# EAGLE design DSI CSI Extender (EAGLE 6.6.0)
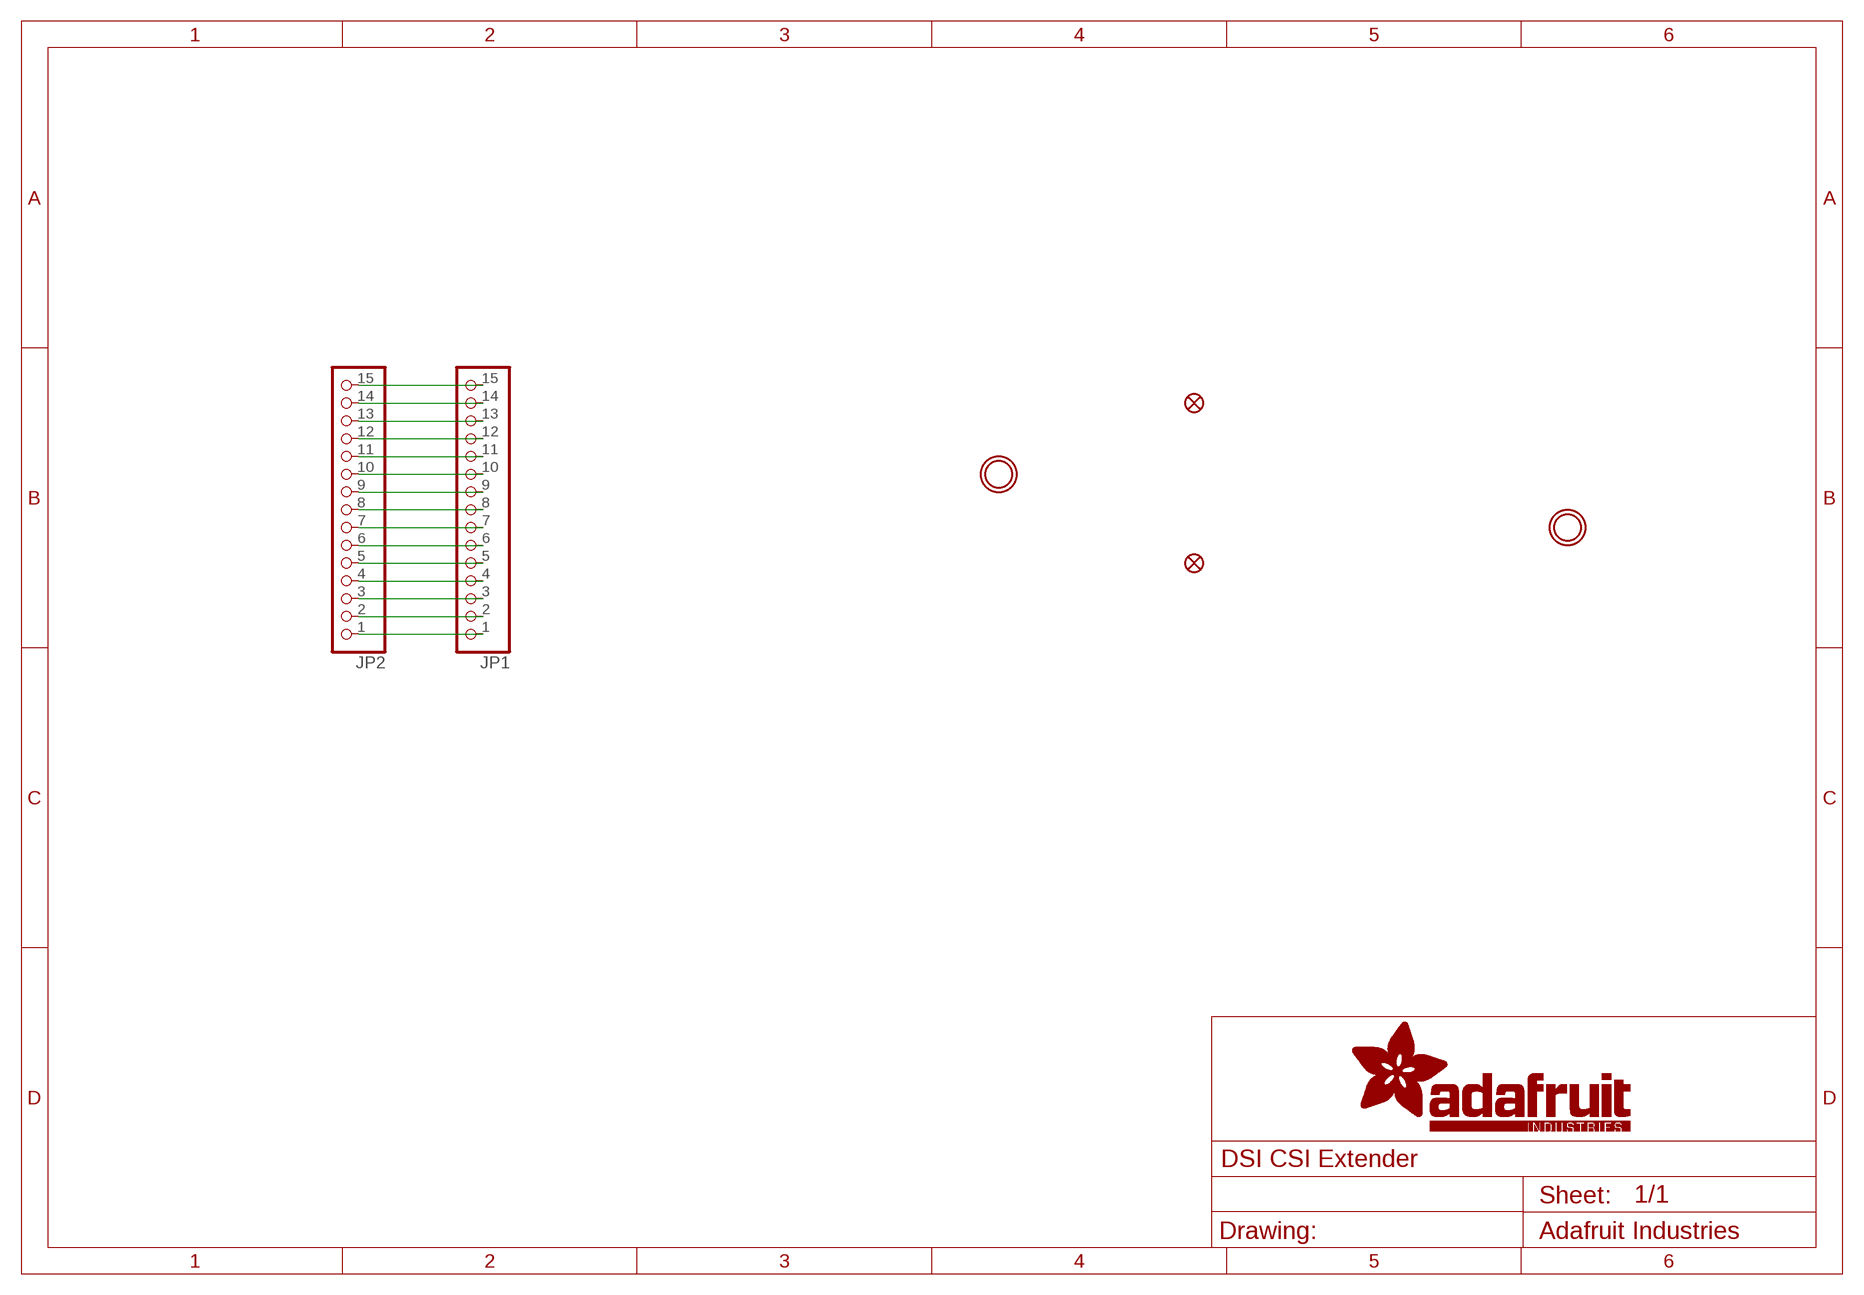
[diagram p0: schematic, sheet 1]

## Parts
FID1  FIDUCIAL_1MM  [FIDUCIAL_1MM]
FID2  FIDUCIAL_1MM  [FIDUCIAL_1MM]
JP1  HEADER-1X15_FPC1MM_PI  [FPC_15PIN_1.0MM]
JP2  HEADER-1X15_FPC1MM_PI  [FPC_15PIN_1.0MM]
U$2  MOUNTINGHOLE2.5  [MOUNTINGHOLE_2.5_PLATED]
U$3  MOUNTINGHOLE2.5  [MOUNTINGHOLE_2.5_PLATED]

## Nets
N$1: JP1.1 JP2.1
N$2: JP1.2 JP2.2
N$3: JP1.3 JP2.3
N$4: JP1.4 JP2.4
N$5: JP1.5 JP2.5
N$6: JP1.6 JP2.6
N$7: JP1.7 JP2.7
N$8: JP1.8 JP2.8
N$9: JP1.9 JP2.9
N$10: JP1.10 JP2.10
N$11: JP1.11 JP2.11
N$12: JP1.12 JP2.12
N$13: JP1.13 JP2.13
N$14: JP1.14 JP2.14
N$15: JP1.15 JP2.15

## Library data of the parts
FID1 FID2 = microbuilder:FIDUCIAL: Fiducial Alignment Points Various fiducial points for machine vision alignment.; BOM: EXCLUDE
JP1 JP2 = microbuilder:HEADER-1X15: 1x15 Header
U$2 U$3 = microbuilder:MOUNTINGHOLE: Mounting Hole For #2 screws (0.086"/2.18mm width, 0.094"/2.4mm hole) use 2.5mm; BOM: EXCLUDE

## Board
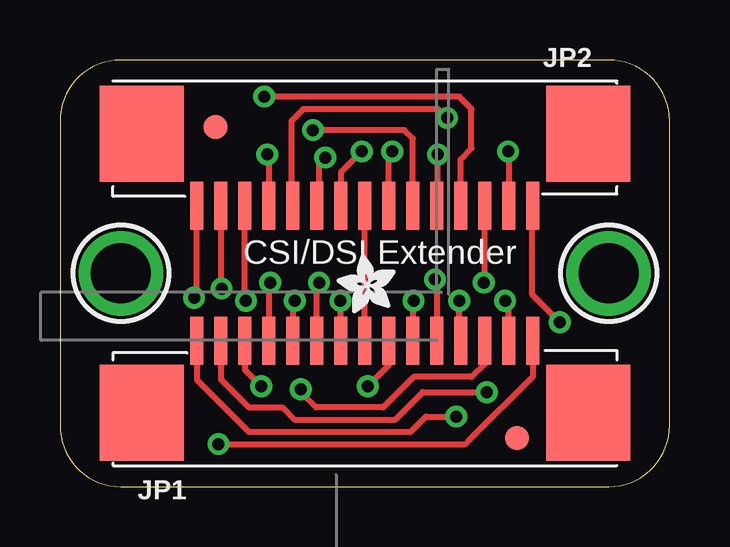
[diagram p1: board, top side]
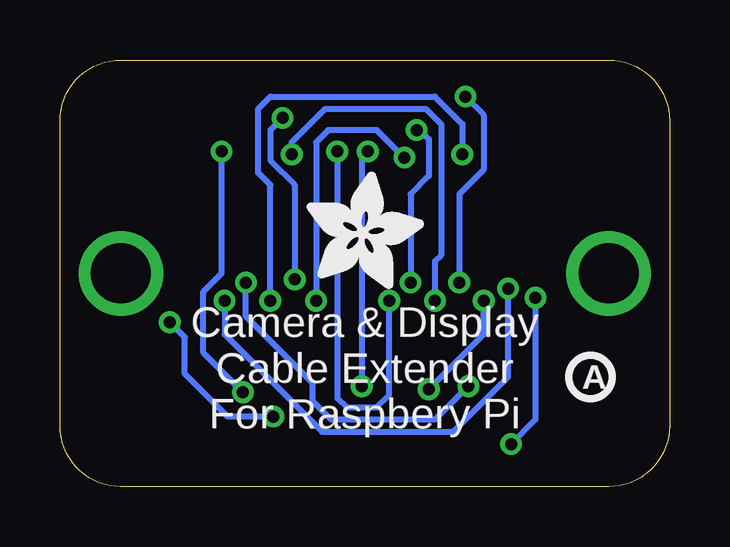
[diagram p2: board, bottom side, seen from below]

Size 25.4 x 17.78 mm. Coordinates in mm from the lower left corner, seen from the top.
Outline: 0,15.24 0,2.54 arc90 2.54,0 22.86,0 arc90 25.4,2.54 25.4,15.24 arc90 22.86,17.78 2.54,17.78 arc90 0,15.24
Copper layers (1*16): Top 0.035mm / dielectric 1.5mm / Bottom 0.035mm
Design rules "adafruit *": minimum track width 8mil, minimum drill 16mil, track to track 8mil, track to pad 8mil, pad to pad 8mil, via to via 8mil, smd to smd 8mil, copper to edge 10mil, drill to drill 8mil, minimum pad ring 10mil, minimum via ring 8mil, stop-mask expansion 4mil, vias tented up to drill 20mil, thermal gap 10mil

### Footprints (pad centres in the part's own frame; a part is rotated, then mirrored left to right if it is on the bottom)
FIDUCIAL_1MM = smd 1 x 1: 1 0,0
FPC_15PIN_1.0MM = smd 0.55 x 2: 1 -7,1; 2 -6,1; 3 -5,1; 4 -4,1; 5 -3,1; 6 -2,1; 7 -1,1; 8 0,1; 9 1,1; 10 2,1; 11 3,1; 12 4,1; 13 5,1; 14 6,1; 15 7,1 | smd 3.5 x 4: M1 -9.3,-2; M2 9.3,-2
MOUNTINGHOLE_2.5_PLATED = drill 2.5 pad 3.2: P$1 0,0

### Placement (x,y rotation side)
FID1  19.05,2.03 0 top
FID2  6.48,14.99 0 top
JP1  12.7,5.08 0 top
JP2  12.7,12.7 180 top
U$2  2.54,8.89 0 top
U$3  22.86,8.89 0 top
U$4  [ADAFRUIT_2.5MM]  13.97,7.24 90 top
U$5  [ADAFRUIT_5MM]  15.11,8.26 0 bottom
U$6  [PCBFEAT-REV-040]  3.3,4.57 0 bottom

### Tracks (layer width: path | path; a pad name or v marks a point on that pad's centre or on a via)
N$1  (via drill 0.5)
  Top 0.254: JP1.1 5.7,4.46 7.87,2.29 14.61,2.29 15.24,2.92 v16.51,2.92 | v20.83,6.86 19.68,8 19.68,11.69 JP2.1
  Bottom 0.254: v16.51,2.92 18.41,2.92 20.19,4.7 20.19,6.22 v20.83,6.86
N$2  (via drill 0.5)
  Top 0.254: JP1.2 6.7,4.48 7.87,3.3 9.27,3.3 9.78,2.79 13.97,2.79 15.11,3.94 v17.78,3.94 | v18.67,13.97 18.7,13.94 JP2.2
  Bottom 0.254: v17.78,3.94 19.43,5.59 19.43,8.13 18.67,8.89 v18.67,13.97
N$3  (via drill 0.5)
  Top 0.254: JP1.3 7.7,4.87 v8.38,4.19 | JP2.3 17.7,8.56 v17.65,8.51
  Bottom 0.254: v8.38,4.19 9.78,2.79 14.1,2.79 14.86,3.56 14.86,4.32 17.65,7.11 v17.65,8.51
N$4  (via drill 0.5)
  Top 0.254: JP2.4 16.7,13.65 17.14,14.1 17.14,15.75 16.64,16.26 v8.51,16.26 | v8.76,8.51 8.7,8.45 JP1.4
  Bottom 0.254: v8.51,16.26 7.75,15.49 7.75,13.21 8.76,12.19 v8.76,8.51
N$5  (via drill 0.5)
  Top 0.254: JP2.5 15.75,11.75 v15.75,13.84 | v9.78,7.75 9.7,7.67 JP1.5
  Bottom 0.254: v15.75,13.84 15.75,14.35 14.35,15.75 10.16,15.75 9.53,15.11 9.53,9.65 9.78,9.4 v9.78,7.75
N$6  (via drill 0.5)
  Top 0.254: JP2.6 14.7,14.51 14.35,14.86 v10.54,14.86 | JP1.6 10.7,8.41 v10.79,8.51
  Bottom 0.254: v10.54,14.86 10.54,14.99 10.03,14.48 10.03,12.95 10.79,12.19 v10.79,8.51
N$7  (via drill 0.5)
  Top 0.254: JP2.7 13.7,13.83 v13.84,13.97 | JP1.7 11.7,7.73 v11.68,7.75
  Bottom 0.254: v13.84,13.97 13.84,3.68 13.46,3.3 12.19,3.3 11.68,3.81 v11.68,7.75
N$8
  Top 0.254: JP1.8 JP2.8
N$9  (via drill 0.5)
  Top 0.254: JP1.9 13.7,5.06 v12.83,4.19 | v12.57,13.97 11.7,13.1 JP2.9
  Bottom 0.254: v12.57,13.97 12.83,13.72 v12.83,4.19
N$10  (via drill 0.5)
  Top 0.254: JP2.10 10.79,11.79 10.79,13.46 v11.05,13.72 | v14.73,7.75 14.7,7.71 JP1.10
  Bottom 0.254: v11.05,13.72 12.19,14.86 14.22,14.86 14.73,14.35 v14.73,7.75
N$11  (via drill 0.5)
  Top 0.254: JP2.11 9.65,11.75 9.65,15.24 10.16,15.75 15.75,15.75 v16.13,15.37 | v15.62,8.64 15.7,8.56 JP1.11
  Bottom 0.254: v16.13,15.37 16.64,14.86 16.64,13.59 15.62,12.57 v15.62,8.64
N$12  (via drill 0.5)
  Top 0.254: JP1.12 16.64,6.14 v16.64,7.75 | v8.64,13.84 8.7,13.78 JP2.12
  Bottom 0.254: v16.64,7.75 16.64,12.57 17.14,13.08 17.14,15.75 16.64,16.26 9.78,16.26 8.64,15.11 v8.64,13.84
N$13  (via drill 0.5)
  Top 0.254: JP1.13 17.7,5.13 17.14,4.57 14.73,4.57 13.46,3.3 10.67,3.3 10.03,3.94 v10.03,4.06 | v7.75,7.75 7.7,7.79 JP2.13
  Bottom 0.254: v10.03,4.06 7.75,6.35 v7.75,7.75
N$14  (via drill 0.5)
  Top 0.254: JP1.14 18.7,7.59 v18.54,7.75 | JP2.14 6.7,8.29 v6.73,8.26
  Bottom 0.254: v18.54,7.75 18.54,6.35 14.48,2.29 9.02,2.29 6.73,4.57 v6.73,8.26
N$15  (via drill 0.5)
  Top 0.254: JP1.15 19.7,4.59 17.08,1.97 16.89,1.78 v6.6,1.78 | JP2.15 5.7,7.99 v5.59,7.87
  Bottom 0.254: v5.59,7.87 5.59,2.79 v6.6,1.78

### Text on the board
tPlace: CSI/DSI Extender
bPlace: Camera & Display / Cable Extender / For Raspbery Pi